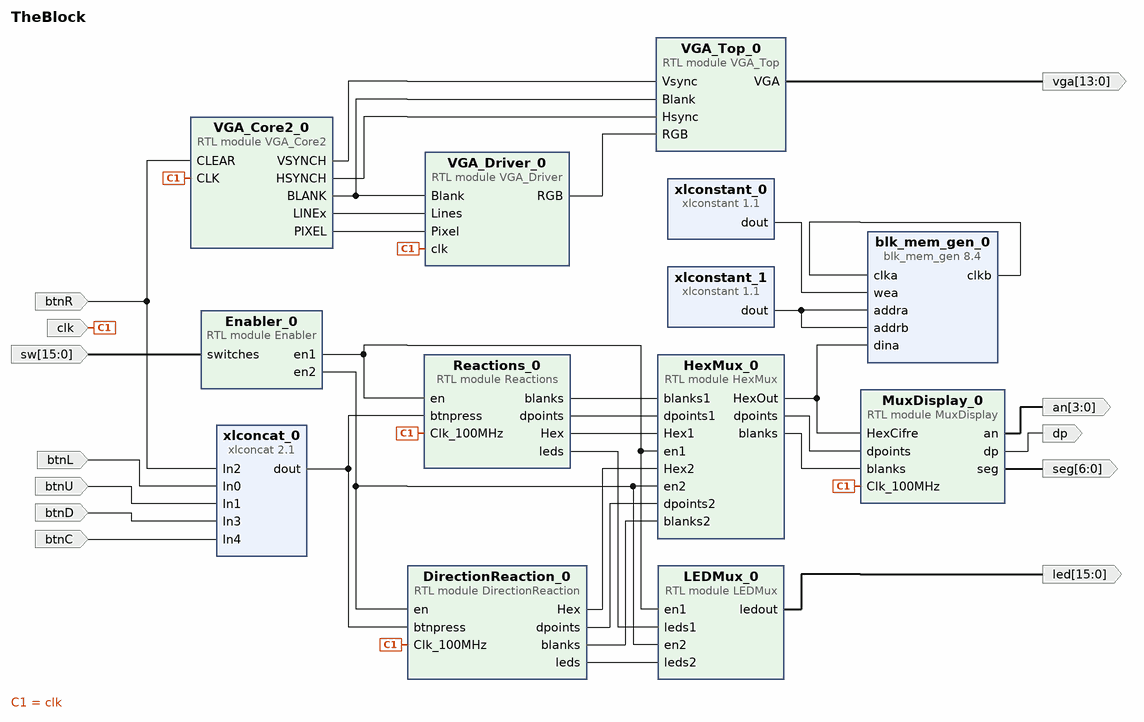
[diagram p0: block diagram of the top level]
# Vivado block design TheBlock, xc7a35tcpg236-1, Vivado 2019.1
create_bd_design TheBlock

create_bd_port -dir I -type clk clk
create_bd_port -dir I -from 15 -to 0 sw
create_bd_port -dir I btnL
create_bd_port -dir I btnR
create_bd_port -dir I btnC
create_bd_port -dir I btnD
create_bd_port -dir I btnU
create_bd_port -dir O -from 3 -to 0 an
create_bd_port -dir O -from 6 -to 0 seg
create_bd_port -dir O dp
create_bd_port -dir O -from 15 -to 0 led
create_bd_port -dir O -from 13 -to 0 vga

create_bd_cell -type module -reference MuxDisplay MuxDisplay_0
create_bd_cell -type module -reference Enabler Enabler_0
create_bd_cell -type module -reference LEDMux LEDMux_0
create_bd_cell -type module -reference HexMux HexMux_0
create_bd_cell -type module -reference Reactions Reactions_0
create_bd_cell -type ip -vlnv xilinx.com:ip:xlconcat:2.1 xlconcat_0
set_property -dict {CONFIG.NUM_PORTS 5} [get_bd_cells xlconcat_0]
create_bd_cell -type module -reference DirectionReaction DirectionReaction_0
create_bd_cell -type ip -vlnv xilinx.com:ip:blk_mem_gen:8.4 blk_mem_gen_0
set_property -dict [list \
  CONFIG.Assume_Synchronous_Clk false \
  CONFIG.Enable_32bit_Address false \
  CONFIG.Enable_A Always_Enabled \
  CONFIG.Enable_B Always_Enabled \
  CONFIG.Memory_Type Simple_Dual_Port_RAM \
  CONFIG.Operating_Mode_A NO_CHANGE \
  CONFIG.Port_A_Write_Rate 50 \
  CONFIG.Port_B_Clock 100 \
  CONFIG.Port_B_Enable_Rate 100 \
  CONFIG.Read_Width_B 16 \
  CONFIG.Register_PortB_Output_of_Memory_Core true \
  CONFIG.Register_PortB_Output_of_Memory_Primitives false \
  CONFIG.Use_Byte_Write_Enable false \
  CONFIG.Use_RSTB_Pin false \
  CONFIG.Write_Depth_A 8 \
  CONFIG.Write_Width_A 16 \
  CONFIG.Write_Width_B 16 \
  CONFIG.use_bram_block Stand_Alone \
] [get_bd_cells blk_mem_gen_0]
create_bd_cell -type ip -vlnv xilinx.com:ip:xlconstant:1.1 xlconstant_0
create_bd_cell -type ip -vlnv xilinx.com:ip:xlconstant:1.1 xlconstant_1
set_property -dict {CONFIG.CONST_WIDTH 3} [get_bd_cells xlconstant_1]
create_bd_cell -type module -reference VGA_Core2 VGA_Core2_0
create_bd_cell -type module -reference VGA_Top VGA_Top_0
create_bd_cell -type module -reference VGA_Driver VGA_Driver_0

# ---- connections ----

connect_bd_net -net sw_0_1 [get_bd_ports sw] [get_bd_pins Enabler_0/switches]
connect_bd_net [get_bd_pins Enabler_0/en1] [get_bd_pins Reactions_0/en] [get_bd_pins LEDMux_0/en1] [get_bd_pins HexMux_0/en1]
connect_bd_net [get_bd_pins Reactions_0/leds] [get_bd_pins LEDMux_0/leds1]
connect_bd_net [get_bd_pins Enabler_0/en2] [get_bd_pins LEDMux_0/en2] [get_bd_pins HexMux_0/en2] [get_bd_pins DirectionReaction_0/en]
connect_bd_net [get_bd_pins Reactions_0/blanks] [get_bd_pins HexMux_0/blanks1]
connect_bd_net [get_bd_pins Reactions_0/dpoints] [get_bd_pins HexMux_0/dpoints1]
connect_bd_net [get_bd_pins Reactions_0/Hex] [get_bd_pins HexMux_0/Hex1]
connect_bd_net [get_bd_pins HexMux_0/HexOut] [get_bd_pins MuxDisplay_0/HexCifre] [get_bd_pins blk_mem_gen_0/dina]
connect_bd_net [get_bd_pins HexMux_0/dpoints] [get_bd_pins MuxDisplay_0/dpoints]
connect_bd_net [get_bd_pins HexMux_0/blanks] [get_bd_pins MuxDisplay_0/blanks]
connect_bd_net [get_bd_pins MuxDisplay_0/an] [get_bd_ports an]
connect_bd_net [get_bd_pins MuxDisplay_0/seg] [get_bd_ports seg]
connect_bd_net [get_bd_pins MuxDisplay_0/dp] [get_bd_ports dp]
connect_bd_net [get_bd_pins LEDMux_0/ledout] [get_bd_ports led]
connect_bd_net [get_bd_ports btnL] [get_bd_pins xlconcat_0/In0]
connect_bd_net [get_bd_ports btnU] [get_bd_pins xlconcat_0/In1]
connect_bd_net [get_bd_ports btnR] [get_bd_pins xlconcat_0/In2] [get_bd_pins VGA_Core2_0/CLEAR]
connect_bd_net [get_bd_ports btnD] [get_bd_pins xlconcat_0/In3]
connect_bd_net [get_bd_ports btnC] [get_bd_pins xlconcat_0/In4]
connect_bd_net [get_bd_pins xlconcat_0/dout] [get_bd_pins Reactions_0/btnpress] [get_bd_pins DirectionReaction_0/btnpress]
connect_bd_net [get_bd_ports clk] \
  [get_bd_pins MuxDisplay_0/Clk_100MHz] [get_bd_pins Reactions_0/Clk_100MHz] [get_bd_pins DirectionReaction_0/Clk_100MHz] \
  [get_bd_pins VGA_Core2_0/CLK] [get_bd_pins VGA_Driver_0/clk]
connect_bd_net [get_bd_pins DirectionReaction_0/Hex] [get_bd_pins HexMux_0/Hex2]
connect_bd_net [get_bd_pins DirectionReaction_0/dpoints] [get_bd_pins HexMux_0/dpoints2]
connect_bd_net [get_bd_pins DirectionReaction_0/blanks] [get_bd_pins HexMux_0/blanks2]
connect_bd_net [get_bd_pins DirectionReaction_0/leds] [get_bd_pins LEDMux_0/leds2]
connect_bd_net [get_bd_pins blk_mem_gen_0/clkb] [get_bd_pins blk_mem_gen_0/clka]
connect_bd_net [get_bd_pins xlconstant_0/dout] [get_bd_pins blk_mem_gen_0/wea]
connect_bd_net [get_bd_pins xlconstant_1/dout] [get_bd_pins blk_mem_gen_0/addra] [get_bd_pins blk_mem_gen_0/addrb]
connect_bd_net [get_bd_pins VGA_Core2_0/VSYNCH] [get_bd_pins VGA_Top_0/Vsync]
connect_bd_net [get_bd_pins VGA_Core2_0/BLANK] [get_bd_pins VGA_Top_0/Blank] [get_bd_pins VGA_Driver_0/Blank]
connect_bd_net [get_bd_pins VGA_Driver_0/RGB] [get_bd_pins VGA_Top_0/RGB]
connect_bd_net [get_bd_pins VGA_Top_0/VGA] [get_bd_ports vga]
connect_bd_net [get_bd_pins VGA_Core2_0/LINEx] [get_bd_pins VGA_Driver_0/Lines]
connect_bd_net [get_bd_pins VGA_Core2_0/PIXEL] [get_bd_pins VGA_Driver_0/Pixel]
connect_bd_net [get_bd_pins VGA_Core2_0/HSYNCH] [get_bd_pins VGA_Top_0/Hsync]

validate_bd_design
save_bd_design
